# EAGLE design arm-pro-mini (EAGLE 6.5.0)
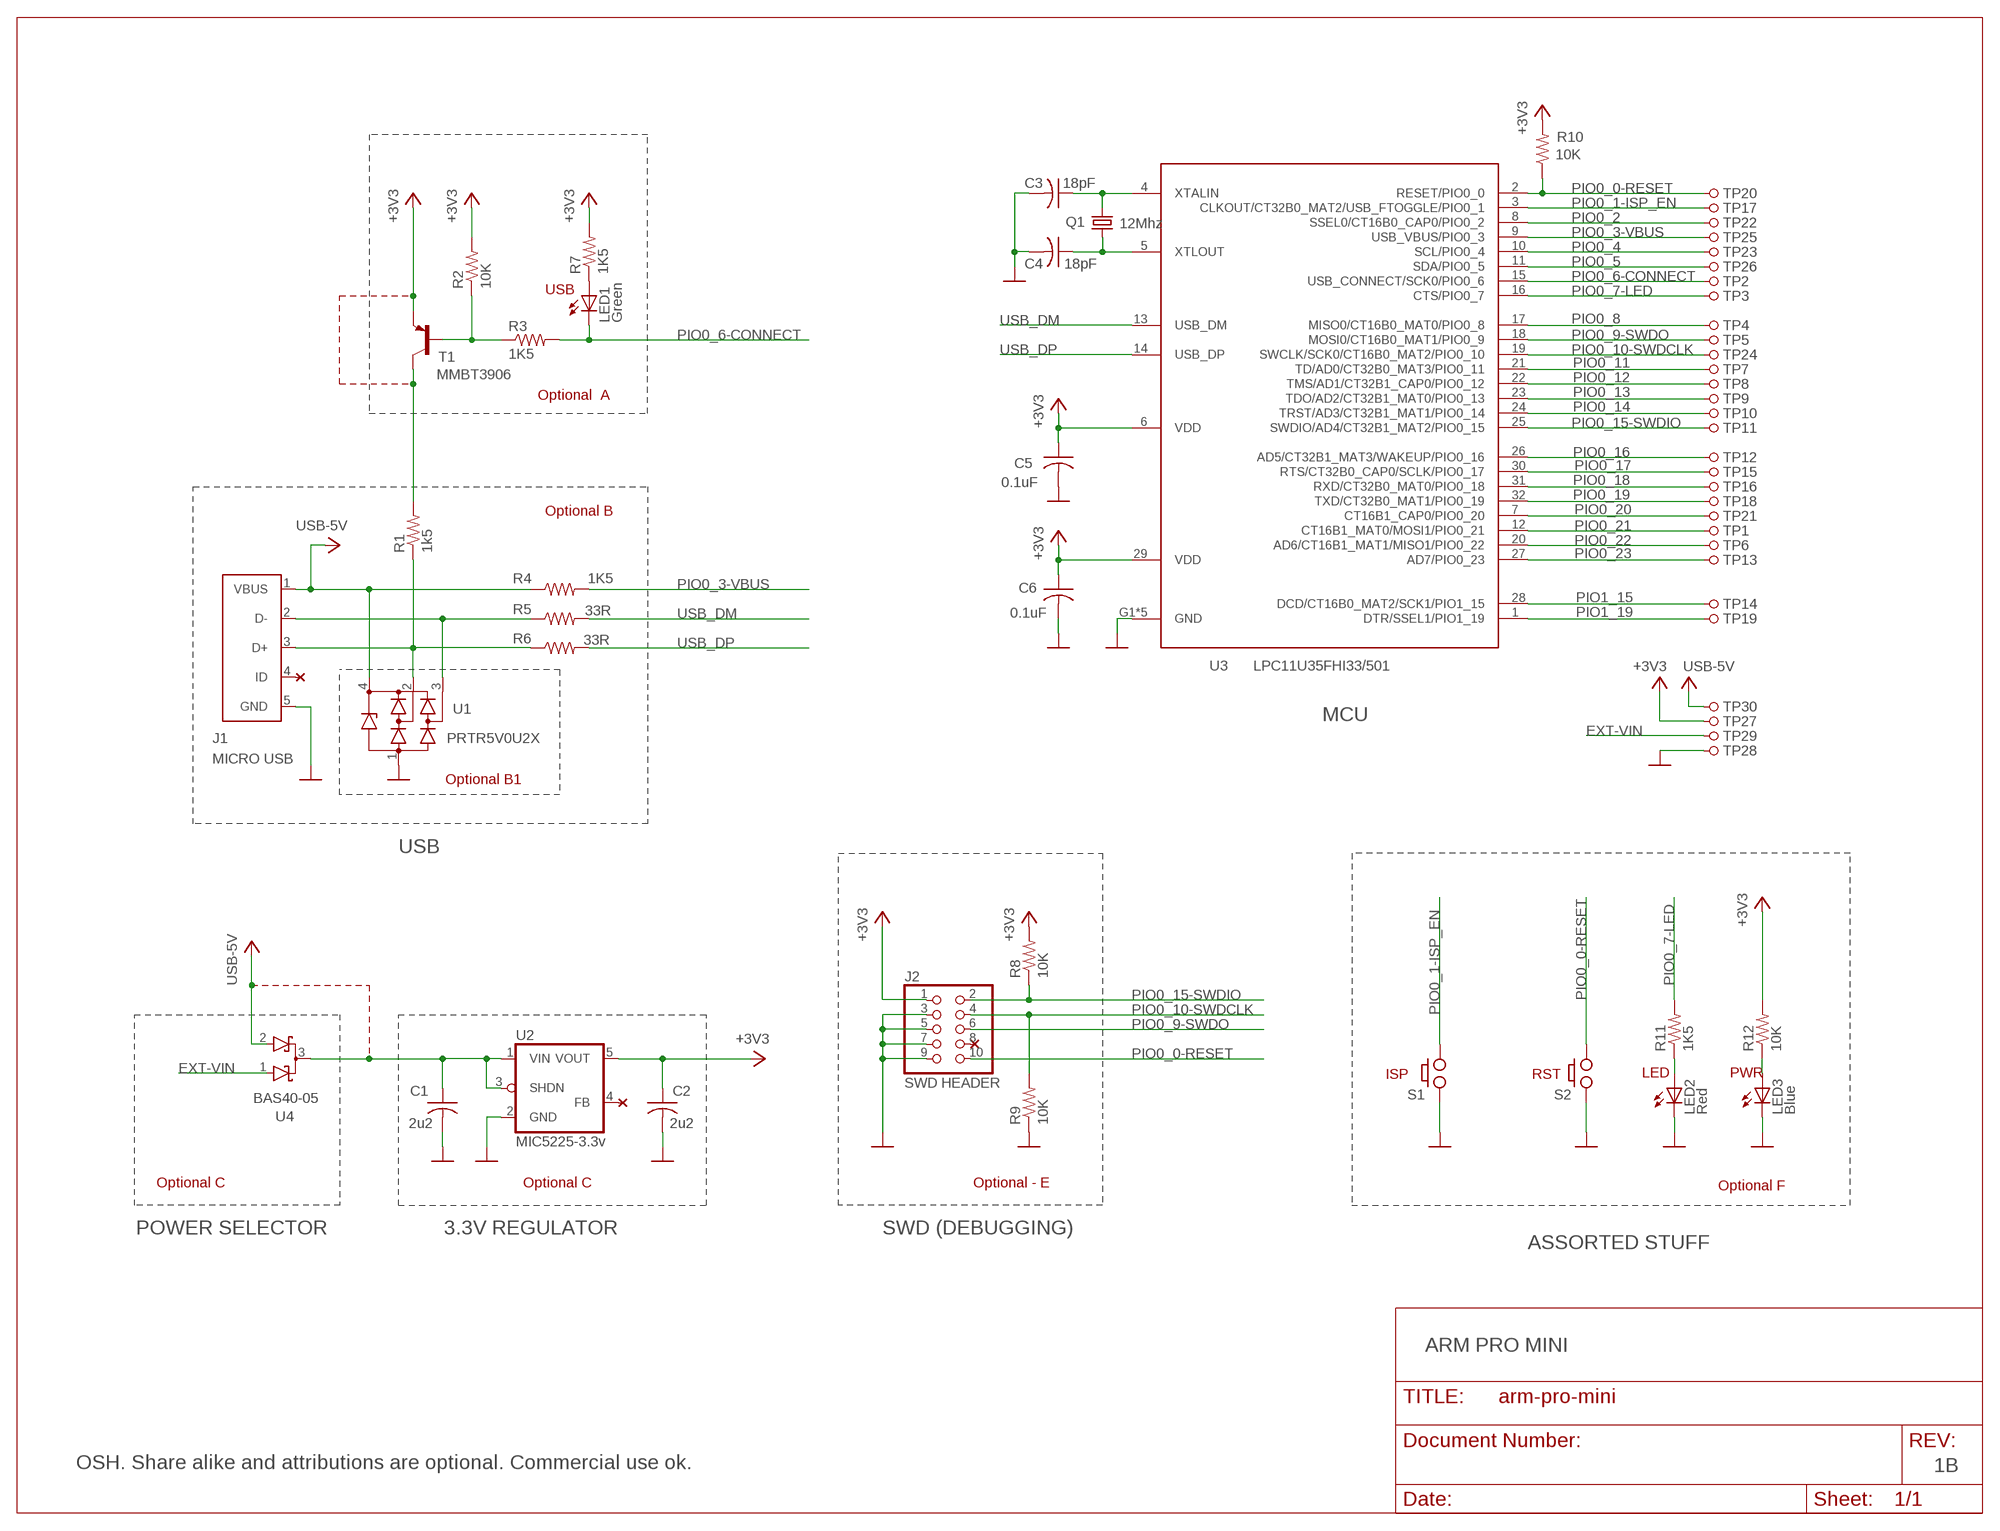
[diagram p0: schematic, sheet 1]

## Parts
C1  2u2  CAPACITORC0603K  [C0603K]
C2  2u2  CAPACITORC0603K  [C0603K]
C3  18pF  C-USC0402K  [C0402K]
C4  18pF  C-USC0402K  [C0402K]
C5  0.1uF  CAPACITORC0603K  [C0603K]
C6  0.1uF  CAPACITORC0603K  [C0603K]
J1  MICRO USB  USB  [USB-MICRO-ZX62RD-AB-5P8]
J2  SWD HEADER  SWD-HEADER  [SWD-HEADER]
LED1  Green  LEDCHIP-LED0603  [CHIP-LED0603]
LED2  Red  LEDCHIP-LED0603  [CHIP-LED0603]
LED3  Blue  LEDCHIP-LED0603  [CHIP-LED0603]
Q1  12Mhz  CRYSTALCTS406  [CRYSTAL]
R1  1k5  R-US_R0402  [R0402]
R2  10K  R-US_R0402  [R0402]
R3  1K5  R-US_R0402  [R0402]
R4  1K5  R-US_R0402  [R0402]
R5  33R  R-US_R0402  [R0402]
R6  33R  R-US_R0402  [R0402]
R7  1K5  R-US_R0402  [R0402]
R8  10K  R-US_R0402  [R0402]
R9  10K  R-US_R0402  [R0402]
R10  10K  R-US_R0402  [R0402]
R11  1K5  R-US_R0402  [R0402]
R12  10K  R-US_R0402  [R0402]
S1  PUSH_BUTTON  [PUSH_BUTTON]
S2  PUSH_BUTTON  [PUSH_BUTTON]
T1  MMBT3906  BC857B-PNP-SOT23-BEC  [SOT23-BEC]
TP1  HDR1  PINHD-1X1SQUARE  [1X01-SQUARE]
TP2  HDR1  PINHD-1X1  [1X01]
TP3  HDR1  PINHD-1X1  [1X01]
TP4  HDR1  PINHD-1X1  [1X01]
TP5  HDR1  PINHD-1X1  [1X01]
TP6  HDR1  PINHD-1X1  [1X01]
TP7  HDR1  PINHD-1X1  [1X01]
TP8  HDR1  PINHD-1X1  [1X01]
TP9  HDR1  PINHD-1X1  [1X01]
TP10  HDR1  PINHD-1X1  [1X01]
TP11  HDR1  PINHD-1X1  [1X01]
TP12  HDR1  PINHD-1X1  [1X01]
TP13  HDR1  PINHD-1X1  [1X01]
TP14  HDR1  PINHD-1X1  [1X01]
TP15  HDR1  PINHD-1X1  [1X01]
TP16  HDR1  PINHD-1X1  [1X01]
TP17  HDR1  PINHD-1X1  [1X01]
TP18  HDR1  PINHD-1X1  [1X01]
TP19  HDR1  PINHD-1X1  [1X01]
TP20  HDR1  PINHD-1X1  [1X01]
TP21  HDR1  PINHD-1X1  [1X01]
TP22  HDR1  PINHD-1X1  [1X01]
TP23  HDR1  PINHD-1X1  [1X01]
TP24  HDR1  PINHD-1X1  [1X01]
TP25  HDR1  PINHD-1X1  [1X01]
TP26  HDR1  PINHD-1X1  [1X01]
TP27  HDR1  PINHD-1X1  [1X01]
TP28  HDR1  PINHD-1X1  [1X01]
TP29  HDR1  PINHD-1X1  [1X01]
TP30  HDR1  PINHD-1X1  [1X01]
U1  PRTR5V0U2X  [SOT143B]
U2  MIC5225-3.3v  TC1015  [SOT25]
U3  LPC11U35FHI33/501  LPC11U35FHN33/501  [HVQFN33-5MM]
U4  BAS40-05  [SOT23]

## Nets
+3V3: C2.1 C5.1 C6.1 J2.1 R2.2 R7.2 R8.2 R10.2 R12.2 T1.E TP27.1 U2.5(VOUT) U3.6(VDD) U3.29(VDD)
EXT-VIN: TP29.1 U4.1(A1)
GND: C1.2 C2.2 C3.2 C4.2 C5.2 C6.2 J1.5(GND) J2.3 J2.5 J2.7 J2.9 LED2.C LED3.C R9.1 S1.A1 S2.A1 TP28.1 U1.1(GND) U2.2(GND) U3.G1(GND) U3.G2(GND) U3.G3(GND) U3.G4(GND) U3.TAB(GND)
N$1: C3.1 Q1.3 U3.4(XTALIN)
N$2: LED3.A R12.1
N$3: C4.1 Q1.1 U3.5(XTLOUT)
N$4: R2.1 R3.1 T1.B
N$5: R1.2 T1.C
N$6: LED2.A R11.1
N$7: LED1.A R7.1
N$8: J1.3(D+) R1.1 R6.1 U1.2(IO1)
N$9: J1.2(D-) R5.1 U1.3(IO2)
N$10: C1.1 U2.1(VIN) U2.3(SHDN) U4.3(C)
PIO0_0-RESET: J2.10 R10.1 S2.B2 TP20.1 U3.2(RESET/PIO0_0)
PIO0_1-ISP_EN: S1.B2 TP17.1 U3.3(CLKOUT/CT32B0_MAT2/USB_FTOGGLE/PIO0_1)
PIO0_2: TP22.1 U3.8(SSEL0/CT16B0_CAP0/PIO0_2)
PIO0_3-VBUS: R4.2 TP25.1 U3.9(USB_VBUS/PIO0_3)
PIO0_4: TP23.1 U3.10(SCL/PIO0_4)
PIO0_5: TP26.1 U3.11(SDA/PIO0_5)
PIO0_6-CONNECT: LED1.C R3.2 TP2.1 U3.15(USB_CONNECT/SCK0/PIO0_6)
PIO0_7-LED: R11.2 TP3.1 U3.16(CTS/PIO0_7)
PIO0_8: TP4.1 U3.17(MISO0/CT16B0_MAT0/PIO0_8)
PIO0_9-SWDO: J2.6 TP5.1 U3.18(MOSI0/CT16B0_MAT1/PIO0_9)
PIO0_10-SWDCLK: J2.4 R9.2 TP24.1 U3.19(SWCLK/SCK0/CT16B0_MAT2/PIO0_10)
PIO0_11: TP7.1 U3.21(TD/AD0/CT32B0_MAT3/PIO0_11)
PIO0_12: TP8.1 U3.22(TMS/AD1/CT32B1_CAP0/PIO0_12)
PIO0_13: TP9.1 U3.23(TDO/AD2/CT32B1_MAT0/PIO0_13)
PIO0_14: TP10.1 U3.24(TRST/AD3/CT32B1_MAT1/PIO0_14)
PIO0_15-SWDIO: J2.2 R8.1 TP11.1 U3.25(SWDIO/AD4/CT32B1_MAT2/PIO0_15)
PIO0_16: TP12.1 U3.26(AD5/CT32B1_MAT3/WAKEUP/PIO0_16)
PIO0_17: TP15.1 U3.30(RTS/CT32B0_CAP0/SCLK/PIO0_17)
PIO0_18: TP16.1 U3.31(RXD/CT32B0_MAT0/PIO0_18)
PIO0_19: TP18.1 U3.32(TXD/CT32B0_MAT1/PIO0_19)
PIO0_20: TP21.1 U3.7(CT16B1_CAP0/PIO0_20)
PIO0_21: TP1.1 U3.12(CT16B1_MAT0/MOSI1/PIO0_21)
PIO0_22: TP6.1 U3.20(AD6/CT16B1_MAT1/MISO1/PIO0_22)
PIO0_23: TP13.1 U3.27(AD7/PIO0_23)
PIO1_15: TP14.1 U3.28(DCD/CT16B0_MAT2/SCK1/PIO1_15)
PIO1_19: TP19.1 U3.1(DTR/SSEL1/PIO1_19)
USB-5V: J1.1(VBUS) R4.1 TP30.1 U1.4(VCC) U4.2(A2)
USB_DM [critical]: R5.2 U3.13(USB_DM)
USB_DP [critical]: R6.2 U3.14(USB_DP)
Unconnected: J1.4(ID) J2.8 U2.4(FB)

## Notes on the sheet
- USB
- Optional  A
- Optional B
- MCU
- Optional B1
- USB
- ISP | RST | LED | PWR
- Optional C | Optional C | Optional - E | Optional F
- POWER SELECTOR | 3.3V REGULATOR | SWD (DEBUGGING)
- ASSORTED STUFF
- ARM PRO MINI
- OSH. Share alike and attributions are optional. Commercial use ok. | 1B

## Library data of the parts
C1 C2 C5 C6 = arm-pro-mini:CAPACITOR: CAPACITOR, American symbol
C3 C4 = arm-pro-mini:C-US: CAPACITOR, American symbol
J1 = arm-pro-mini:USB
J2 = arm-pro-mini:SWD-HEADER: PIN HEADER
LED1-LED3 = arm-pro-mini:LED: LED OSRAM: - CHIPLED LG R971, LG N971, LY N971, LG Q971, LY Q971, LO R971, LY R971 LH N974, LH R974 LS Q976, LO Q976, LY Q976 LO Q996 - Hyper CHIPLED LW Q18S LB Q993, LB Q99A, LB R99A - SideLED LS A670, LO A670, LY A670, LG A670, LP A670 LB A673, LV A673, LT A673, LW A673 LH A674 LY A675 LS A676, LA A676, LO A676, LY A676, LW A676 LS A679, LY A679, LG A679 - Hyper Micro SIDELED® LS Y876, LA Y876, LO Y876, LY Y876 LT Y87S - SmartLED LW L88C, LW L88S LB L89C, LB L89S, LG L890 LS L89K, LO L89K, LY L89K LS L896, LA L896, LO L896, LY L896 - TOPLED LS T670, LO T670, LY T670, LG T670, LP T670 LSG T670, LSP T670, LSY T670, LOP T670, LYG T670 LG T671, LOG T671, LSG T671 LB T673, LV T673, LT T673, LW T673 LH T674 LS T676, LA T676, LO T676, LY T676, LB T676, LH T676, LSB T676, LW T676 LB T67C, LV T67C, LT T67C, LS T67K, LO T67K, LY T67K, LW E67C LS E67B, LA E67B, LO E67B, LY E67B, LB E67C, LV E67C, LT E67C LW T67C LS T679, LY T679, LG T679 LS T770, LO T770, LY T770, LG T770, LP T770 LB T773, LV T773, LT T773, LW T773 LH T774 LS E675, LA E675, LY E675, LS T675 LS T776, LA T776, LO T776, LY T776, LB T776 LHGB T686 LT T68C, LB T68C - Hyper Mini TOPLED® LB M676 - Mini TOPLED Santana® LG M470 LS M47K, LO M47K, LY M47K Source: http://www.osram.convergy.de LUXEON: - LUMILED® LXK2-PW12-R00, LXK2-PW12-S00, LXK2-PW14-U00, LXK2-PW14-V00 LXK2-PM12-R00, LXK2-PM12-S00, LXK2-PM14-U00 LXK2-PE12-Q00, LXK2-PE12-R00, LXK2-PE12-S00, LXK2-PE14-T00, LXK2-PE14-U00 LXK2-PB12-K00, LXK2-PB12-L00, LXK2-PB12-M00, LXK2-PB14-N00, LXK2-PB14-P00, LXK2-PB14-Q00 LXK2-PR12-L00, LXK2-PR12-M00, LXK2-PR14-Q00, LXK2-PR14-R00 LXK2-PD12-Q00, LXK2-PD12-R00, LXK2-PD12-S00 LXK2-PH12-R00, LXK2-PH12-S00 LXK2-PL12-P00, LXK2-PL12-Q00, LXK2-PL12-R00 Source: www.luxeon.com KINGBRIGHT: KA-3528ASYC Source: www.kingbright.com
Q1 = arm-pro-mini:CRYSTAL: CRYSTAL; OC_FARNELL: unknown; OC_NEWARK: unknown
R1-R12 = arm-pro-mini:R-US_: RESISTOR, American symbol
S1 S2 = arm-pro-mini:PUSH_BUTTON: CKN10502CT-ND
T1 = arm-pro-mini:*-PNP-: PNP Transistror
TP1-TP30 = arm-pro-mini:PINHD-1X1: PIN HEADER
U1 = arm-pro-mini:PRTR5V0U2X
U2 = arm-pro-mini:TC1015: 150mA Low Noise LDO Voltage Regulator with Enable TSC [Taiwan Semiconductor Company, Ltd] Source: http://www.taiwansemi.com .. 5205_0409c.pdf
U3 = arm-pro-mini:LPC11U35FHN33/501
U4 = arm-pro-mini:BAS40-05: Silicon Schottky Diodes General-purpose diode for high-speed switching

## Net classes
1 power: width 0.254 mm

## Board
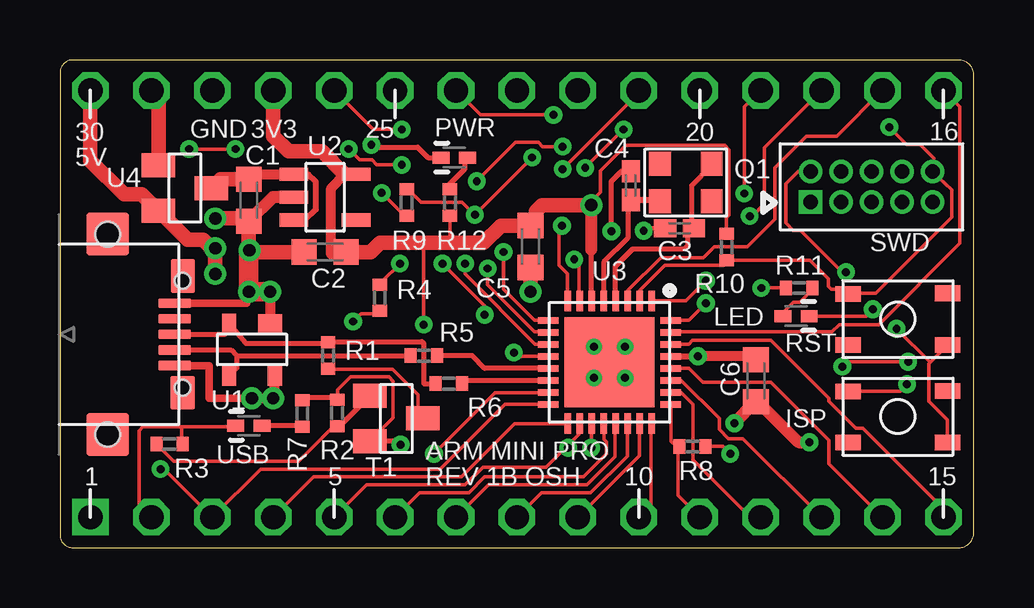
[diagram p1: board, top side]
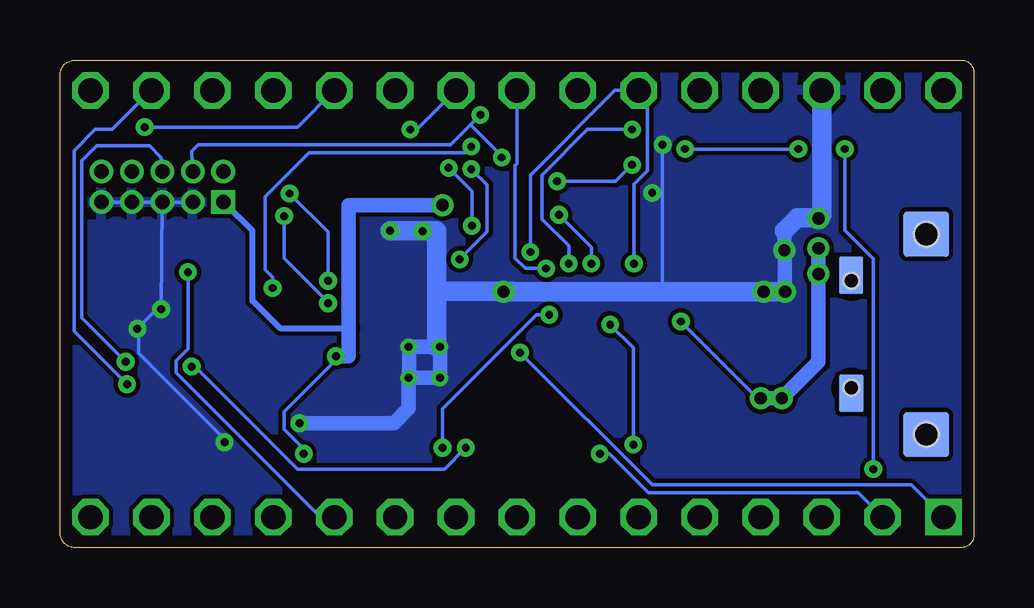
[diagram p2: board, bottom side, seen from below]

Size 38.1 x 20.32 mm. Coordinates in mm from the lower left corner, seen from the top.
Outline: 38.1,0.64 38.1,19.68 arc90 37.47,20.32 0.54,20.32 arc90 0,19.78 0,0.54 arc90 0.54,0 37.47,0 arc90 38.1,0.64
Copper layers (1*16): Top 0.035mm / dielectric 1.5mm / Bottom 0.035mm
Design rules "default *": minimum track width 6mil, minimum drill 13mil, track to track 7mil, track to pad 6mil, pad to pad 6mil, via to via 8mil, smd to smd 0mil, copper to edge 20mil, drill to drill 8mil, minimum pad ring 7mil, minimum via ring 8mil, stop-mask expansion 4mil, vias tented up to drill 20mil, thermal gap 10mil

### Footprints (pad centres in the part's own frame; a part is rotated, then mirrored left to right if it is on the bottom)
C0603K = smd 1.05 x 1.08: 1 -0.875,0; 2 0.875,0
C0402K = smd 0.925 x 0.74: 1 -0.6,0; 2 0.6,0
USB-MICRO-ZX62RD-AB-5P8 = smd 0.4 x 1.35: 1 1.3,5.425; 2 0.65,5.425; 3 0,5.425; 4 -0.65,5.425; 5 -1.3,5.425 | smd 1.778 x 1.778: A1 -4.175,2.625; B1 4.175,2.625 | smd 1.88 x 1.88 bottom: A2 -4.175,2.625; B2 4.175,2.625 | smd 1.422 x 1.016: C1 -2.431,5.757; D1 2.435,5.749 | smd 1.575 x 1.016 bottom: C2 -2.457,5.757; D2 2.461,5.749 | hole 0.65: -2.225,5.75; 2.225,5.75 | hole 1.016: 4.175,2.625; -4.175,2.625
SWD-HEADER = drill 0.6 pad 0.991 square: 1 -2.54,-0.635 | drill 0.6 pad 0.991: 2 -2.54,0.635; 3 -1.27,-0.635; 4 -1.27,0.635; 5 0,-0.635; 6 0,0.635; 7 1.27,-0.635; 8 1.27,0.635; 9 2.54,-0.635; 10 2.54,0.635
CHIP-LED0603 = smd 0.5 x 0.7: A 0,-0.55; C 0,0.55
CRYSTAL = smd 0.9 x 1: 1 -1.075,-0.775; 2 1.075,-0.775; 3 1.075,0.775; 4 -1.075,0.775
R0402 = smd 0.5 x 0.6: 1 -0.55,0; 2 0.55,0
PUSH_BUTTON = smd 1.05 x 0.65: A1 -2.075,1.075; A2 2.075,1.075; B1 -2.075,-1.075; B2 2.075,-1.05
SOT23-BEC = smd 1 x 1.4: B -0.95,-1.1; C 0,1.1; E 0.95,-1.1
1X01-SQUARE = drill 1.016 square: 1 0,0
1X01 = drill 1.016 octagon: 1 0,0
SOT143B = smd 1 x 0.8: 1 -0.75,-1.075 | smd 0.6 x 0.85: 2 0.95,-1.075; 3 0.95,1.075; 4 -0.95,1.075
SOT25 = smd 0.55 x 1.2: 1 -0.95,-1.3; 2 0,-1.3; 3 0.95,-1.3; 4 0.95,1.3; 5 -0.95,1.3
HVQFN33-5MM = smd 0.85 x 0.27: 1 -2.55,1.75; 2 -2.55,1.25; 3 -2.55,0.75; 4 -2.55,0.25; 5 -2.55,-0.25; 6 -2.55,-0.75; 7 -2.55,-1.25; 8 -2.55,-1.75; 17 2.55,-1.75; 18 2.55,-1.25; 19 2.55,-0.75; 20 2.55,-0.25; 21 2.55,0.25; 22 2.55,0.75; 23 2.55,1.25; 24 2.55,1.75 | smd 0.27 x 0.85: 9 -1.75,-2.55; 10 -1.25,-2.55; 11 -0.75,-2.55; 12 -0.25,-2.55; 13 0.25,-2.55; 14 0.75,-2.55; 15 1.25,-2.55; 16 1.75,-2.55; 25 1.75,2.55; 26 1.25,2.55; 27 0.75,2.55; 28 0.25,2.55; 29 -0.25,2.55; 30 -0.75,2.55; 31 -1.25,2.55; 32 -1.75,2.55 | drill 0.33 pad 0.6: G1 -0.65,0.65; G2 -0.65,-0.65; G3 0.65,-0.65; G4 0.65,0.65 | smd 3.75 x 3.75: TAB 0,0
SOT23 = smd 1 x 1.4: 1 -0.95,-1.1; 2 0.95,-1.1; 3 0,1.1

### Placement (x,y rotation side)
C1  7.87,14.48 270 top
C2  11.05,12.32 180 top
C3  25.83,13.31 180 top
C4  23.8,15.09 90 top
C5  19.61,12.55 270 top
C6  29.01,6.96 270 top
J1  -0.64,8.89 270 top
J2  33.83,15.04 0 top
LED1  7.87,5.08 90 top
LED2  30.68,9.65 270 top
LED3  16.43,16.26 90 top
Q1  26.09,15.21 0 top
R1  11.18,8 270 top
R2  11.56,5.61 90 top
R3  4.57,4.32 0 top
R4  10K  [R0402]  13.34,10.41 90 top
R5  15.16,8 0 top
R6  16.21,6.83 0 top
R7  10.11,5.59 90 top
R8  26.37,4.22 0 top
R9  14.45,14.38 90 top
R10  27.79,12.52 90 top
R11  10K  [R0402]  30.81,10.82 180 top
R12  16.26,14.38 270 top
S1  34.92,5.46 180 top
S2  34.92,9.53 180 top
T1  14.02,5.38 270 top
TP1  1.27,1.27 90 top
TP2  3.81,1.27 0 top
TP3  6.35,1.27 0 top
TP4  8.89,1.27 0 top
TP5  11.43,1.27 0 top
TP6  13.97,1.27 0 top
TP7  16.51,1.27 0 top
TP8  19.05,1.27 0 top
TP9  21.59,1.27 0 top
TP10  24.13,1.27 0 top
TP11  26.67,1.27 0 top
TP12  29.21,1.27 0 top
TP13  31.75,1.27 0 top
TP14  34.29,1.27 0 top
TP15  36.83,1.27 0 top
TP16  36.83,19.05 0 top
TP17  34.29,19.05 0 top
TP18  31.75,19.05 0 top
TP19  29.21,19.05 0 top
TP20  26.67,19.05 0 top
TP21  24.13,19.05 0 top
TP22  21.59,19.05 0 top
TP23  19.05,19.05 0 top
TP24  16.51,19.05 0 top
TP25  13.97,19.05 0 top
TP26  11.43,19.05 0 top
TP27  8.89,19.05 0 top
TP28  6.35,19.05 0 top
TP29  3.81,19.05 0 top
TP30  1.27,19.05 0 top
U1  8,8.26 180 top
U2  11.05,14.61 270 top
U3  22.91,7.72 270 top
U4  5.21,14.99 270 top

### Tracks (layer width: path | path; a pad name or v marks a point on that pad's centre or on a via)
+3V3  (via drill 0.33, 0.51)
  Top 0.152: 10.11,6.25 R7.2 | 11.56,6.25 R2.2 11.58,6.33 11.58,6.58 12.12,7.11 13.72,7.11 13.89,6.93 13.89,5.41 12.93,4.45 T1.E | 16.26,12.7 R12.2 | R8.2 27.64,4.22 v27.94,3.91 | R10.2 27.79,13.74 27.89,13.84 27.89,16.59 27.71,16.76 23.6,16.76 22.53,15.7 22.53,14.81 22.28,14.55 v22.15,14.28 | v15.16,9.3 15.16,12.57 15.04,12.7
  Top 0.203: 22.15,10.28 22.15,12.42 | 11.56,6.25 10.11,6.25 | v14.2,4.29 14.06,4.43 T1.E
  Top 0.254: U3.6 22.15,10.28 | 29.01,7.97 C6.1 | U3.29 v26.59,7.97 v26.59,7.98
  Top 0.406: C2.1 11.3,12.21 11.3,14.99 11.87,15.55 U2.5 12.38,15.55 | 29.01,7.97 v26.6,7.97
  Top 0.508: 22.15,12.42 v22.15,14.28
  Top 0.61: v26.6,7.97 v26.59,7.98 | 11.87,15.55 10.92,16.51 9.53,16.51 8.89,17.14 TP27.1 | C2.1 12.95,12.32 13.34,12.7 15.04,12.7 16.26,12.7 17.65,12.7 18.38,13.42 C5.1 19.84,13.65 19.84,14.02 20.09,14.28 v22.15,14.28
  Bottom 0.152: v27.94,3.91 27.94,4.12 28.75,4.93 28.75,5.66 26.72,7.7 v26.59,7.98 | v14.2,4.29 14.2,8.33 v15.16,9.3
  Bottom 0.254: 26.06,9.14 28.93,9.14 30.07,10.29 30.07,13.21 31.27,14.4 J2.1
  Bottom 0.61: v26.59,7.98 26.06,7.98 26.06,9.14 26.06,14.28 v22.15,14.28
EXT-VIN
  Top 0.61: TP29.1 4.11,18.75 U4.1
GND  (via drill 0.33, 0.51)
  Top 0.152: 36.27,7.72 36.98,8.43 S2.A1 | 36.27,7.72 36.22,7.67 36.22,6.1 36.98,5.33 36.98,4.39 S1.A1 | LED2.C 33.6,9.65 v33.88,9.93 | v34.87,9.12 36.27,7.72 | v13.41,14.78 14.45,13.74 R9.1 | U3.G2 U3.TAB | 29.18,5.99 C6.2
  Top 0.203: 8.76,9.33 U1.1 | 23.8,15.6 C4.2 23.41,15.69 22.99,15.27 v22.99,13.18 | v24.33,13.21 24.26,13.26 24.26,13.34 C3.2 | v12.98,16.79 13.08,16.69 14.91,16.69 15.34,16.26 LED3.C
  Top 0.254: 28.99,6.07 C6.2
  Top 0.305: v7.87,10.67 7.78,10.19 J1.5
  Top 0.406: v8.76,10.67 8.76,9.33
  Top 0.508: v28.12,5.18 28.99,6.07 | U2.2 8.88,14.61 C1.2 | v31.24,4.39 30.79,4.39 29.18,5.99
  Top 0.61: v19.61,10.67 C5.2 | C2.2 7.87,12.32 C1.2 7.76,13.72 v6.48,13.72
  Top 0.813: v8.76,10.67 v7.87,10.67 7.87,12.32
  Bottom 0.152: J2.5 v33.88,9.93 33.93,10.06 v34.87,9.12 34.82,9.07 34.82,8.1 31.24,4.52 v31.24,4.39 | J2.5 J2.3 | J2.5 J2.7 J2.9 | v22.99,13.18 22.99,13.21 | 12.98,10.67 12.98,14.78 | 12.98,14.78 v12.98,16.79 | 12.98,14.78 v13.41,14.78 | 19.99,10.69 v19.61,10.67
  Bottom 0.254: 23.56,7.85 U3.G1
  Bottom 0.305: U3.G1 23.55,8.36
  Bottom 0.61: U3.G2 U3.G3 U3.G4 23.56,5.8 24.18,5.18 v28.12,5.18 | U3.G1 U3.G2 | 23.55,8.36 23.55,7.09 | 22.4,8.37 U3.G2 | 6.35,13.84 6.45,13.74 v6.48,13.72 | 7.8,12.39 v7.9,12.39 | v7.9,12.39 7.92,12.39 | 7.9,13.21 v7.9,12.39 | 7.87,12.45 7.87,10.72 | 7.87,10.72 v7.87,10.67 | 7.9,10.67 7.9,10.72 | 7.9,10.72 7.87,10.72 | 7.9,10.72 8.79,10.72
  Bottom 0.813: v7.87,10.67 7.9,10.67 v8.76,10.67 12.98,10.67 v19.61,10.67 | 22.4,10.69 22.4,13.21 22.99,13.21 v24.33,13.21 | 22.4,10.69 22.4,8.37 | TP28.1 6.35,13.84 | 6.45,13.74 7.37,13.74 7.9,13.21 | 19.23,10.69 19.99,10.69 22.4,10.69
  pour Bottom: 0,0 0,20.32 38.1,20.32 38.1,0
N$1
  Top 0.203: C3.1 26.34,13.66 26.34,15.09 27.16,15.91 Q1.3 | 26.43,13.15 C3.1 | U3.4 23.16,11.73 23.88,12.45 26.06,12.45 26.19,12.57 26.19,13.06 C3.1
  Top 0.254: 27.34,15.81 Q1.3
N$2
  Top 0.152: 17.17,16.26 LED3.A | 16.26,15.04 R12.1
  Top 0.203: 17.17,16.26 16.87,16.26 16.87,15.77 16.26,15.16 R12.1
N$3
  Top 0.203: C4.1 23.67,14.36 23.67,12.9 22.66,11.89 U3.5
  Top 0.254: C4.1 24.96,14.49 Q1.1
N$4
  Top 0.152: 12.9,6.33 T1.B | 11.58,5 R2.1 11.56,4.95 11.3,4.95 9.96,3.61 4.75,3.61 4.04,4.32 R3.1
  Top 0.203: 11.58,5 11.59,5 T1.B
N$5
  Top 0.152: 11.18,7.37 R1.2 13.87,7.44 14.94,6.38 14.94,5.56 T1.C
N$6
  Top 0.152: 30.25,9.65 LED2.A 30,9.65 30.58,10.24 30.84,10.24 31.42,10.82 R11.1
N$7
  Top 0.152: 9.98,5.08 10.11,4.95 R7.1
  Top 0.203: 9.98,5.08 LED1.A
N$8
  Top 0.203: J1.3 6.86,8.89 7.05,9.08 U1.2 7.75,8.51 11.13,8.51 R1.1 11.21,8.59 15.09,8.59 15.16,8.51 15.16,6.83 R6.1
N$9
  Top 0.203: J1.2 7.13,8.24 7.37,8 | 7.37,8 R5.1 | 7.18,7.3 U1.3 7.37,7.5 7.37,8
N$10
  Top 0.254: U2.3 10.23,13.65 10.67,14.1 10.67,15.24 10.35,15.55 U2.1
  Top 0.406: C1.1 7.75,15.55 U2.1
  Top 0.61: U4.3 6.32,14.97 6.7,15.35 C1.1
PIO0_0-RESET  (via drill 0.33)
  Top 0.152: U3.2 24.18,10.29 24.18,10.72 25.22,11.76 27.69,11.76 27.79,11.86 R10.1 | 27.84,11.86 R10.1 | v34.57,17.53 35.28,16.82 35.84,16.82 36.42,16.23 J2.10 37.19,14.91 37.19,13.77 34.01,10.59 32.92,10.59 S2.B2 32.84,10.59 32.77,10.59 32.59,10.77 32.16,10.77 32.03,10.9 32.03,11.2 31.26,11.97 R10.1
  Bottom 0.152: TP20.1 28.19,17.53 v34.57,17.53
PIO0_1-ISP_EN  (via drill 0.33)
  Top 0.152: 34.14,19.05 TP17.1 32.38,17.14 31.11,17.14 29.79,15.82 29.79,13.69 28.65,12.55 27.28,12.55 26.82,12.09 25.04,12.09 23.67,10.72 23.67,10.29 U3.3 | v35.31,6.81 35.03,6.53 32.87,6.53 S1.B2
  Bottom 0.152: v35.31,6.81 37.52,9.02 37.52,16.54 36.63,17.42 35.92,17.42 TP17.1
PIO0_2  (via drill 0.33)
  Top 0.152: v20.93,13.41 20.8,13.28 20.8,11.76 21.16,11.4 21.16,10.29 U3.8 | v23.5,17.42 v21.89,15.82
  Bottom 0.152: v20.93,13.41 20.93,14.86 v21.89,15.82 | v23.5,17.42 23.22,17.42 TP22.1
PIO0_3-VBUS  (via drill 0.33)
  Top 0.152: v18.49,12.32 18.49,10.77 19.79,9.47 20.34,9.47 U3.9 | v14.17,11.84 13.41,11.07 13.34,11.07 R4.2
  Bottom 0.152: v18.49,12.32 18.49,15.52 14.96,19.05 TP25.1 13.61,18.69 13.61,15.7 14.17,15.14 v14.17,11.84
PIO0_4  (via drill 0.33)
  Top 0.152: v17.83,11.63 17.83,10.95 19.79,8.99 20.34,8.99 U3.10
  Bottom 0.152: v17.83,11.63 18.69,11.63 19.13,12.06 19.13,15.93 19.05,16 TP23.1
PIO0_5  (via drill 0.33)
  Top 0.152: v16.89,11.84 16.89,11.4 19.81,8.48 20.34,8.48 U3.11 | v14.25,17.42 13.06,17.42 TP26.1
  Bottom 0.152: v16.89,11.84 16.89,12.57 18.01,13.69 18.01,15.52 16.1,17.42 v14.25,17.42
PIO0_6-CONNECT  (via drill 0.33)
  Top 0.152: 5.23,4.32 R3.2 5.16,4.34 5.08,4.34 5.08,5.03 | v15.6,3.91 18.14,6.45 20.34,6.45 U3.15 | TP2.1 3.3,1.78 3.3,4.88 3.45,5.03 5.08,5.03 | 5.08,5.03 7.12,5.03 LED1.C
  Bottom 0.152: v15.6,3.91 15.19,3.91 13.56,2.29 4.83,2.29 TP2.1
PIO0_7-LED  (via drill 0.33)
  Top 0.152: U3.16 20.34,5.97 18.54,5.97 15.85,3.28 8.36,3.28 TP3.1 4.34,3.28 v4.19,3.28 | v29.23,10.82 R11.2 | v20.95,16.71 20.12,16.71 19.94,16.89 19,16.89 v17.37,15.27 | v14.25,15.95 13.21,15.95 13.01,16.15 12.5,16.15 v12.04,16.61 | v5.38,16.61 v7.32,16.61
  Bottom 0.152: v20.95,16.71 21.21,16.46 27.71,16.46 29.54,14.63 29.54,11.58 29.23,11.28 v29.23,10.82 | v17.37,15.27 14.94,15.27 v14.25,15.95 | v7.32,16.61 v12.04,16.61 | v5.38,16.61 5.38,13.23 4.19,12.04 v4.19,3.28
PIO0_8
  Top 0.152: TP4.1 10.57,2.95 16.74,2.95 18.95,5.16 21.16,5.16 U3.17
PIO0_9-SWDO  (via drill 0.33)
  Top 0.152: 21.13,4.22 20.27,3.35 17.63,3.35 16.89,2.62 12.78,2.62 TP5.1 | 21.13,4.22 21.64,4.72 21.64,5.16 U3.18 | v35.36,7.75 32.82,7.75 v32.61,7.54 | v21.18,4.17 21.13,4.22
  Bottom 0.152: v35.36,7.75 37.19,9.58 37.19,16.13 36.58,16.74 34.37,16.74 33.88,16.26 J2.6 | v32.61,7.54 32.46,7.54 28.19,3.28 22.07,3.28 v21.18,4.17
PIO0_10-SWDCLK  (via drill 0.33)
  Top 0.152: v22.15,4.17 22.15,5.16 U3.19 | v17.7,9.7 17.7,10.08 v15.95,11.84 | R9.2 14.45,15.01 15.06,14.4 16.76,14.4 v17.3,13.87 v19.68,16.26 | v20.57,18.03 17.53,18.03 TP24.1
  Bottom 0.152: v22.15,4.17 22.15,5.79 18.24,9.7 v17.7,9.7 | v15.95,11.84 15.95,12.52 v17.3,13.87 | v20.57,18.03 20.98,17.63 | 20.98,17.63 21.82,16.79 32.33,16.79 32.61,16.51 J2.4 | v19.68,16.26 19.68,16.33 20.98,17.63
PIO0_11
  Top 0.152: TP7.1 17.86,2.62 21.97,2.62 23.14,3.79 23.14,5.16 U3.21
PIO0_12
  Top 0.152: TP8.1 20.07,2.29 22.12,2.29 23.65,3.81 23.65,5.16 U3.22
PIO0_13
  Top 0.152: TP9.1 24.16,3.83 24.16,5.16 U3.23
PIO0_14
  Top 0.152: TP10.1 24.64,1.78 24.64,5.16 U3.24
PIO0_15-SWDIO  (via drill 0.33)
  Top 0.152: U3.25 25.48,5.97 25.48,4.45 25.7,4.22 R8.1 25.76,4.17 25.76,2.18 TP11.1 | v32.77,11.48 32.61,11.48 30.86,13.23 30.56,13.23 30.25,13.54 30.25,15.16 30.76,15.67 J2.2 30.96,15.67
  Bottom 0.152: v32.77,11.48 32.77,8.28 33.25,7.8 33.25,7.29 27.23,1.27 TP11.1
PIO0_16
  Top 0.152: TP12.1 28.78,1.27 26.39,3.66 26.39,5.97 25.91,6.45 25.48,6.45 U3.26
PIO0_17
  Top 0.152: TP15.1 36.83,1.63 33.48,4.98 33.17,4.98 32.05,6.1 32.05,6.22 29.64,8.64 26.36,8.64 26.21,8.48 25.48,8.48 U3.30
PIO0_18
  Top 0.152: TP16.1 37.52,18.36 37.52,12.68 34.14,9.3 32.49,9.3 32.18,8.99 25.48,8.99 U3.31
PIO0_19  (via drill 0.33)
  Top 0.152: v26.92,10.19 26.21,9.47 25.48,9.47 U3.32 | v28.75,13.82 28.85,13.82 29.36,14.33 29.36,16.66 TP18.1
  Bottom 0.152: v26.92,10.19 26.92,10.24 28.75,12.06 v28.75,13.82
PIO0_20  (via drill 0.33)
  Top 0.152: v21.44,12.01 21.64,11.81 21.64,10.29 U3.7 | v20.95,15.77 24.13,18.95 TP21.1
  Bottom 0.152: v21.44,12.01 20.3,13.16 20.3,15.11 v20.95,15.77
PIO0_21  (via drill 0.33)
  Top 0.152: v18.92,8.13 19.07,7.98 20.34,7.98 U3.12
  Bottom 0.152: v18.92,8.13 13.41,2.62 2.62,2.62 TP1.1
PIO0_22
  Top 0.152: TP6.1 14.99,2.29 17.04,2.29 17.7,2.95 21.82,2.95 22.78,3.91 22.78,4.42 22.68,4.52 22.68,5.16 U3.20
PIO0_23
  Top 0.152: TP13.1 28.47,4.55 27.86,4.55 27.48,4.93 27.48,5.38 25.91,6.96 25.48,6.96 U3.27
PIO1_15
  Top 0.152: TP14.1 32.05,3.5 32.05,4.47 29.64,6.88 26.8,6.88 26.21,7.47 25.48,7.47 U3.28
PIO1_19  (via drill 0.33)
  Top 0.152: v26.92,11.12 26.09,10.29 24.66,10.29 U3.1 | v28.52,14.76 28.52,18.36 TP19.1
  Bottom 0.152: v26.92,11.12 26.92,13.16 v28.52,14.76
USB-5V  (via drill 0.33, 0.51)
  Top 0.152: v12.22,9.42 12.55,9.75 13.34,9.75 R4.1
  Top 0.305: v8,6.22 6.22,6.22 6.22,7.59 J1.1
  Top 0.406: v8,6.22 8.95,6.22 U1.4
  Top 0.61: TP30.1 1.27,16.13 2.67,14.73 3.41,14.73 U4.2 5.32,12.83 5.97,12.83 6.48,12.32 v6.48,11.4
  Bottom 0.152: v12.22,9.42 9.17,6.38 v8.89,6.22
  Bottom 0.61: v6.48,11.4 6.48,7.75 v8,6.22 v8.89,6.22 8.89,6.25 | v6.48,11.4 v6.48,12.47 | 6.48,12.5 v6.48,11.4
USB_DM
  Top 0.203: U3.13 17.7,7.47 17.2,8 R5.2
USB_DP
  Top 0.203: U3.14 16.89,6.97 R6.2

### Text on the board
tPlace: 30 | GND | 3V3 | 25 | PWR | 20 | 16 | 5V | SWD | LED | RST | ISP | USB | ARM MINI PRO | 1 | 5 | REV 1B OSH | 10 | 15
Document: OSH. Share alike and attributions / are optional. Commercial use ok.